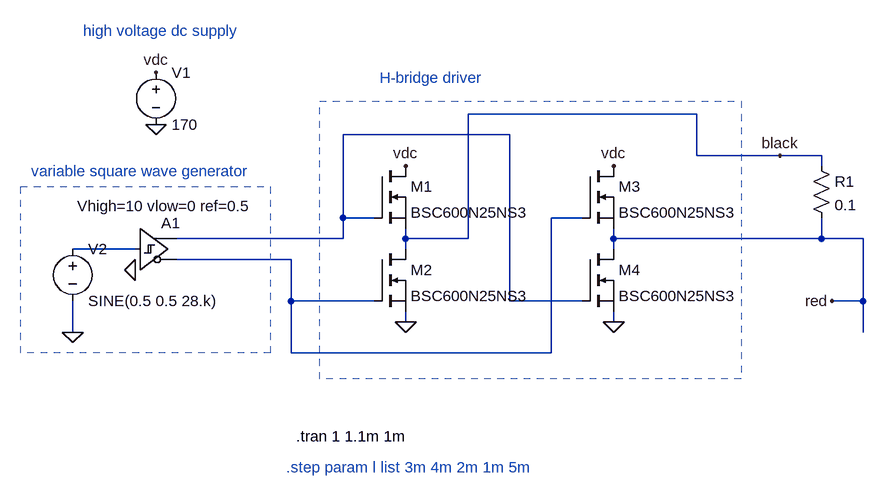
[diagram p0: schematic Draft2.asc]
Draft2.asc, the LTspice schematic file:
Version 4
SHEET 1 1080 680
WIRE 768 96 416 96
WIRE 480 128 224 128
WIRE 768 160 768 96
WIRE 896 160 768 160
WIRE 960 160 896 160
WIRE 960 176 960 160
WIRE 224 256 224 128
WIRE 272 256 224 256
WIRE 592 256 544 256
WIRE 224 288 224 256
WIRE 224 288 -32 288
WIRE 320 288 320 272
WIRE 416 288 416 96
WIRE 416 288 320 288
WIRE 640 288 640 272
WIRE 960 288 960 256
WIRE 960 288 640 288
WIRE 1024 288 960 288
WIRE -96 304 -192 304
WIRE 320 304 320 288
WIRE 640 304 640 288
WIRE 144 320 -32 320
WIRE 144 384 144 320
WIRE 272 384 144 384
WIRE 480 384 480 128
WIRE 592 384 480 384
WIRE 1024 384 1024 288
WIRE 1024 384 976 384
WIRE 320 416 320 400
WIRE 640 416 640 400
WIRE -192 432 -192 384
WIRE 1024 432 1024 384
WIRE 144 464 144 384
WIRE 544 464 544 256
WIRE 544 464 144 464
FLAG -192 432 0
FLAG -96 336 0
FLAG -64 112 0
FLAG 320 416 0
FLAG -64 32 vdc
FLAG 320 176 vdc
FLAG 640 176 vdc
FLAG 640 416 0
FLAG 896 160 black
FLAG 976 384 red
SYMBOL Digital/schmitt -96 240 R0
WINDOW 3 -89 -2 Left 2
SYMATTR InstName A1
SYMATTR Value Vhigh=10 vlow=0 ref=0.5
SYMBOL nmos 272 176 R0
SYMATTR InstName M1
SYMATTR Value BSC600N25NS3
SYMBOL nmos 272 304 R0
SYMATTR InstName M2
SYMATTR Value BSC600N25NS3
SYMBOL voltage -64 16 R0
SYMATTR InstName V1
SYMATTR Value 170
SYMBOL voltage -192 288 R0
SYMATTR InstName V2
SYMATTR Value SINE(0.5 0.5 28.k)
SYMATTR Value2 AC 1
SYMBOL nmos 592 176 R0
SYMATTR InstName M3
SYMATTR Value BSC600N25NS3
SYMBOL nmos 592 304 R0
SYMATTR InstName M4
SYMATTR Value BSC600N25NS3
SYMBOL res 944 160 R0
SYMATTR InstName R1
SYMATTR Value 0.1
TEXT 152 592 Left 2 !.tran 1 1.1m 1m
TEXT 136 640 Left 2 ;.step param l list 3m 4m 2m 1m 5m
TEXT -256 184 Left 2 ;variable square wave generator
TEXT 280 40 Left 2 ;H-bridge driver
TEXT -176 -32 Left 2 ;high voltage dc supply
RECTANGLE Normal 188 76 836 504 2
RECTANGLE Normal -272 208 112 464 2

The netlist it stands for:
* Draft2.asc
A1 N003 0 0 0 0 N002 N001 0 SCHMITT Vhigh=10 vlow=0 ref=0.5
M1 vdc N001 black black BSC600N25NS3
M2 black N002 0 0 BSC600N25NS3
V1 vdc 0 170
V2 N003 0 SINE(0.5 0.5 28.k) AC 1
M3 vdc N002 red red BSC600N25NS3
M4 red N001 0 0 BSC600N25NS3
R1 black red 0.1
.model NMOS NMOS
.model PMOS PMOS
.lib standard.mos
.tran 1 1.1m 1m
* .step param l list 3m 4m 2m 1m 5m
* variable square wave generator
* H-bridge driver
* high voltage dc supply
.backanno
.end